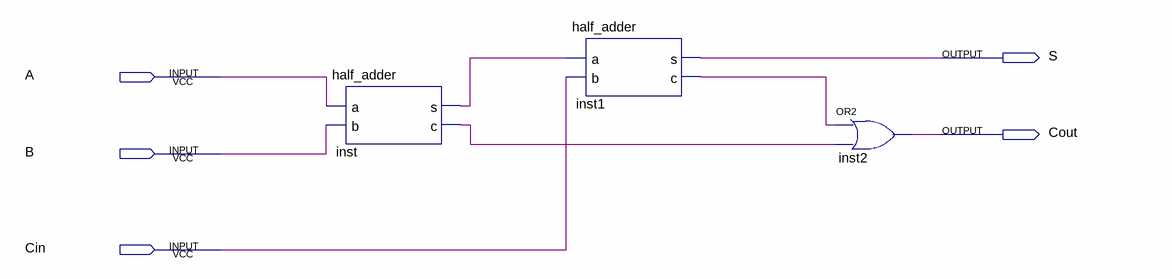
[diagram p0: schematic sheet]
// Quartus schematic schematic_fulladder.bdf as structural Verilog: 3 symbols, 5 pins
module schematic_fulladder (
  input  A,
  input  B,
  input  Cin,
  output S,
  output Cout
);

  wire inst1_c, inst_c, inst_s;

  half_adder inst (.a(A), .b(B), .s(inst_s), .c(inst_c));
  half_adder inst1 (.a(inst_s), .b(Cin), .s(S), .c(inst1_c));
  or inst2 (Cout, inst1_c, inst_c);
endmodule
